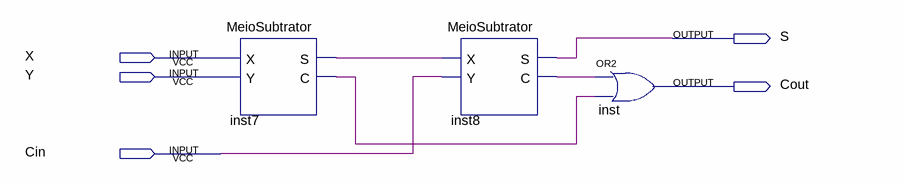
[diagram p0: schematic sheet]
// Quartus schematic SubtratorCompleto.bdf as structural Verilog: 3 symbols, 5 pins
module SubtratorCompleto (
  input  X,
  input  Y,
  input  Cin,
  output S,
  output Cout
);

  wire inst7_c, inst7_s, inst8_c;

  MeioSubtrator inst7 (.X(X), .Y(Y), .S(inst7_s), .C(inst7_c));
  MeioSubtrator inst8 (.X(inst7_s), .Y(Cin), .S(S), .C(inst8_c));
  or inst (Cout, inst8_c, inst7_c);
endmodule
